# EAGLE design 1 (EAGLE 7.6.0)

## Sheet 1 of 2
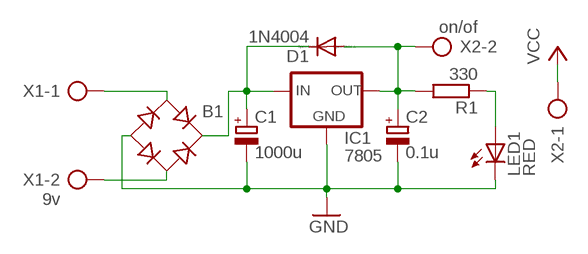
[diagram p0: schematic, sheet 1]

### Parts
B1  RB1A  [RB1A]
C1  1000u  CPOL-EUE3.5-8  [E3,5-8]
C2  0.1u  CPOL-EUE2-5  [E2-5]
D1  1N4004  [DO41-10]
IC1  7805  78XXS  [78XXS]
LED1  RED  LED5MM  [LED5MM]
R1  330  R-EU_0204/7  [0204/7]
X1  9v  AK500/2  [AK500/2]
X2  on/of  AK500/2  [AK500/2]

### Nets
GND: B1.- C1.- C2.- IC1.GND LED1.K(C) ; also sheet 2
N$1: B1.AC1 X1.1
N$2: B1.AC2 X1.2
N$3: B1.+ C1.+ D1.C IC1.IN
N$5: LED1.A R1.1
N$44: C2.+ D1.A IC1.OUT R1.2 X2.2
VCC: X2.1 ; also sheet 2

## Sheet 2 of 2
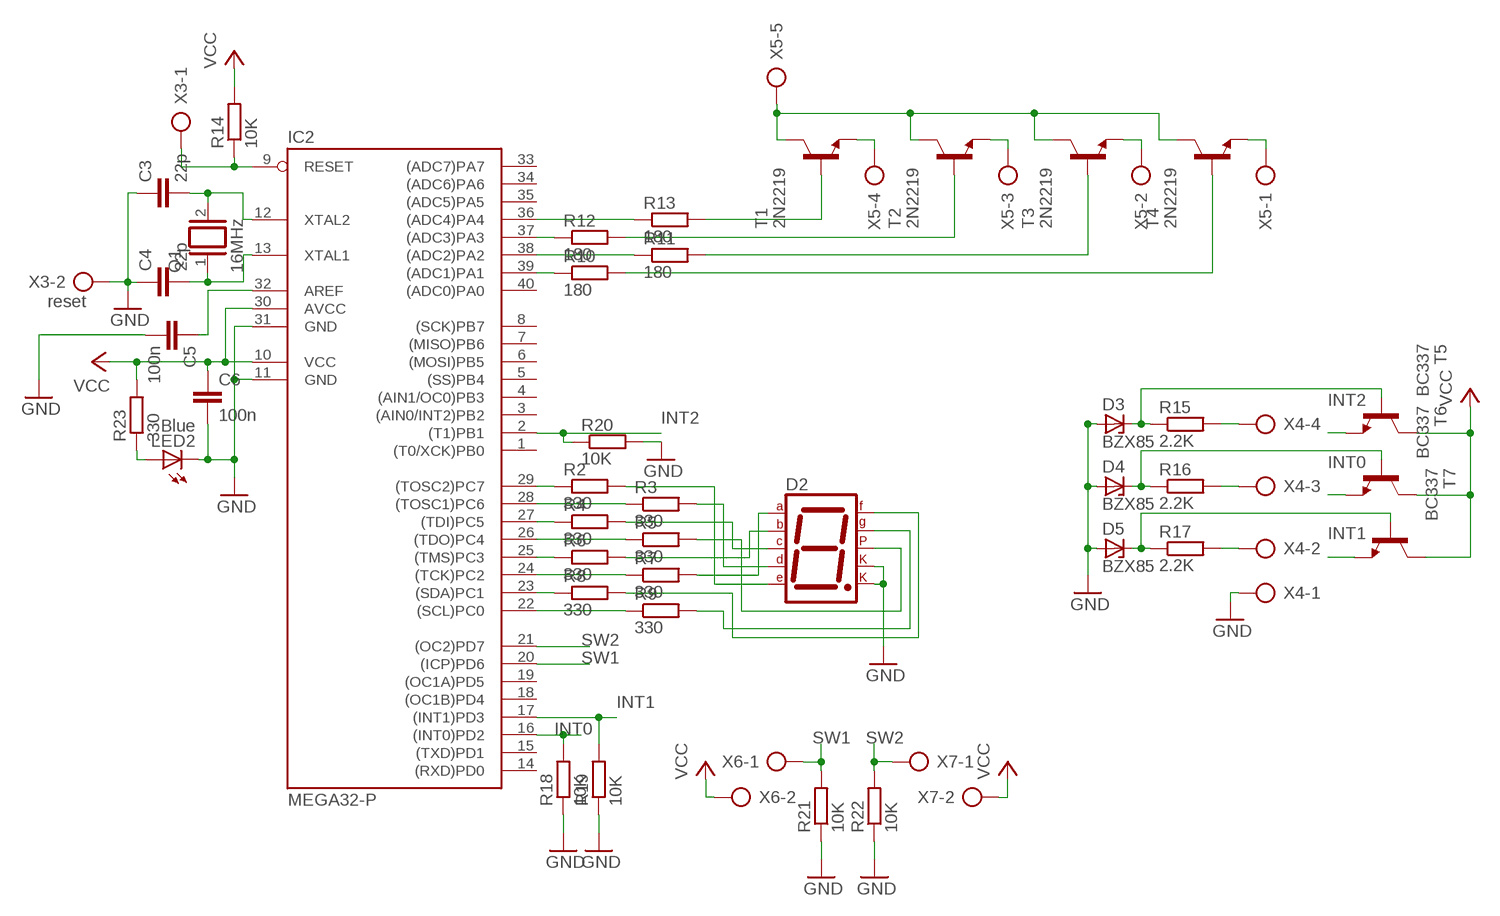
[diagram p1: schematic, sheet 2]

### Parts
C3  22p  C-EU025-024X044  [C025-024X044]
C4  22p  C-EU025-024X044  [C025-024X044]
C5  100n  C-EU025-024X044  [C025-024X044]
C6  100n  C-EU025-024X044  [C025-024X044]
D2  7SEG-CK  [7SEG-13]
D3  BZX85  [DO41Z10]
D4  BZX85  [DO41Z10]
D5  BZX85  [DO41Z10]
IC2  MEGA32-P  [DIL40]
LED2  Blue  LED5MM  [LED5MM]
Q1  16MHz  XTAL  [Q]
R2  330  R-EU_0204/7  [0204/7]
R3  330  R-EU_0204/7  [0204/7]
R4  330  R-EU_0204/7  [0204/7]
R5  330  R-EU_0204/7  [0204/7]
R6  330  R-EU_0204/7  [0204/7]
R7  330  R-EU_0204/7  [0204/7]
R8  330  R-EU_0204/7  [0204/7]
R9  330  R-EU_0204/7  [0204/7]
R10  180  R-EU_0204/7  [0204/7]
R11  180  R-EU_0204/7  [0204/7]
R12  180  R-EU_0204/7  [0204/7]
R13  180  R-EU_0204/7  [0204/7]
R14  10K  R-EU_0204/7  [0204/7]
R15  2.2K  R-EU_0207/10  [0207/10]
R16  2.2K  R-EU_0207/10  [0207/10]
R17  2.2K  R-EU_0207/10  [0207/10]
R18  10K  R-EU_0204/7  [0204/7]
R19  10K  R-EU_0204/7  [0204/7]
R20  10K  R-EU_0204/7  [0204/7]
R21  10K  R-EU_0204/7  [0204/7]
R22  10K  R-EU_0204/7  [0204/7]
R23  330  R-EU_0204/7  [0204/7]
T1  2N2219  [TO5]
T2  2N2219  [TO5]
T3  2N2219  [TO5]
T4  2N2219  [TO5]
T5  BC337  [TO92]
T6  BC337  [TO92]
T7  BC337  [TO92]
X3  reset  AK500/2  [AK500/2]
X4  AK500/4  [AK500/4]
X5  AK500/5  [AK500/5]
X6  AK500/2  [AK500/2]
X7  AK500/2  [AK500/2]

### Nets
GND: C3.1 C4.1 C5.2 C6.2 D2.3(CK1) D2.8(CK2) D3.A D4.A D5.A IC2.11(GND) IC2.31(GND) LED2.K(C) R18.1 R19.1 R20.2 R21.1 R22.1 X3.2 X4.1 ; also sheet 1
INT0: IC2.16((INT0)PD2) R18.2 T6.1(E)
INT1: IC2.17((INT1)PD3) R19.2 T7.1(E)
INT2: IC2.2((T1)PB1) R20.1 T5.1(E)
N$4: D2.1(E) R2.2
N$6: D2.2(D) R3.2
N$7: D2.4(C) R4.2
N$8: D2.5(DP) R5.2
N$9: D2.6(B) R6.2
N$10: D2.7(A) R7.2
N$11: D2.9(F) R8.2
N$12: D2.10(G) R9.2
N$13: IC2.29((TOSC2)PC7) R2.1
N$14: IC2.28((TOSC1)PC6) R3.1
N$15: IC2.27((TDI)PC5) R4.1
N$16: IC2.26((TDO)PC4) R5.1
N$17: IC2.25((TMS)PC3) R6.1
N$18: IC2.24((TCK)PC2) R7.1
N$19: IC2.23((SDA)PC1) R8.1
N$20: IC2.22((SCL)PC0) R9.1
N$21: IC2.39((ADC1)PA1) R10.1
N$22: IC2.38((ADC2)PA2) R11.1
N$23: IC2.37((ADC3)PA3) R12.1
N$24: IC2.36((ADC4)PA4) R13.1
N$25: LED2.A R23.1
N$26: C3.2 IC2.12(XTAL2) Q1.2
N$27: C4.2 IC2.13(XTAL1) Q1.1
N$28: IC2.9(RESET) R14.1 X3.1
N$29: D3.C R15.1 T5.2(B)
N$30: D4.C R16.1 T6.2(B)
N$31: D5.C R17.1 T7.2(B)
N$32: R15.2 X4.4
N$33: R16.2 X4.3
N$34: R17.2 X4.2
N$35: R12.2 T2.2(B)
N$36: R13.2 T1.2(B)
N$37: R11.2 T3.2(B)
N$38: R10.2 T4.2(B)
N$39: T1.3(C) T2.3(C) T3.3(C) T4.3(C) X5.5
N$40: T1.1(E) X5.4
N$41: T2.1(E) X5.3
N$42: T3.1(E) X5.2
N$43: T4.1(E) X5.1
N$45: C5.1 IC2.32(AREF)
SW1: IC2.20((ICP)PD6) R21.2 X6.1
SW2: IC2.21((OC2)PD7) R22.2 X7.1
VCC: C6.1 IC2.10(VCC) IC2.30(AVCC) R14.2 R23.2 T5.3(C) T6.3(C) T7.3(C) X6.2 X7.2 ; also sheet 1
Unconnected: IC2.1((T0/XCK)PB0) IC2.3((AIN0/INT2)PB2) IC2.4((AIN1/OC0)PB3) IC2.5((SS)PB4) IC2.6((MOSI)PB5) IC2.7((MISO)PB6) IC2.8((SCK)PB7) IC2.14((RXD)PD0) IC2.15((TXD)PD1) IC2.18((OC1B)PD4) IC2.19((OC1A)PD5) IC2.33((ADC7)PA7) IC2.34((ADC6)PA6) IC2.35((ADC5)PA5) IC2.40((ADC0)PA0)

## Library data of the parts
B1 = rectifier:RB1A: RECTIFIER 1 A
C1 C2 = rcl:CPOL-EU: POLARIZED CAPACITOR, European symbol
C3-C6 = rcl:C-EU: CAPACITOR, European symbol
D1 = diode:1N4004: DIODE general purpose rectifier, 1 A
D2 = special:7SEG-CK: 7-segment DISPLAY single cathode, 13 mm
D3-D5 = diode:BZX85: Z DIODE
IC1 = v-reg:78XXS: VOLTAGE REGULATOR
IC2 = atmel:MEGA32-P: MICROCONTROLLER 32 Kbytes FLASH 2 Kbytes SRAM 1 Kbytes EEPROM USART 8-channel 10 bit ADC Source: www.atmel.com .. doc2503.pdf; MPN: ATMEGA32-16PU; OC_FARNELL: 1661729; OC_NEWARK: 51P1794
LED1 LED2 = led:LED: LED OSRAM: - CHIPLED LG R971, LG N971, LY N971, LG Q971, LY Q971, LO R971, LY R971 LH N974, LH R974 LS Q976, LO Q976, LY Q976 LO Q996 - Hyper CHIPLED LW Q18S LB Q993, LB Q99A, LB R99A - SideLED LS A670, LO A670, LY A670, LG A670, LP A670 LB A673, LV A673, LT A673, LW A673 LH A674 LY A675 LS A676, LA A676, LO A676, LY A676, LW A676 LS A679, LY A679, LG A679 - Hyper Micro SIDELED® LS Y876, LA Y876, LO Y876, LY Y876 LT Y87S - SmartLED LW L88C, LW L88S LB L89C, LB L89S, LG L890 LS L89K, LO L89K, LY L89K LS L896, LA L896, LO L896, LY L896 - TOPLED LS T670, LO T670, LY T670, LG T670, LP T670 LSG T670, LSP T670, LSY T670, LOP T670, LYG T670 LG T671, LOG T671, LSG T671 LB T673, LV T673, LT T673, LW T673 LH T674 LS T676, LA T676, LO T676, LY T676, LB T676, LH T676, LSB T676, LW T676 LB T67C, LV T67C, LT T67C, LS T67K, LO T67K, LY T67K, LW E67C LS E67B, LA E67B, LO E67B, LY E67B, LB E67C, LV E67C, LT E67C LW T67C LS T679, LY T679, LG T679 LS T770, LO T770, LY T770, LG T770, LP T770 LB T773, LV T773, LT T773, LW T773 LH T774 LS E675, LA E675, LY E675, LS T675 LS T776, LA T776, LO T776, LY T776, LB T776 LHGB T686 LT T68C, LB T68C - Hyper Mini TOPLED® LB M676 - Mini TOPLED Santana® LG M470 LS M47K, LO M47K, LY M47K Source: http://www.osram.convergy.de LUXEON: - LUMILED® LXK2-PW12-R00, LXK2-PW12-S00, LXK2-PW14-U00, LXK2-PW14-V00 LXK2-PM12-R00, LXK2-PM12-S00, LXK2-PM14-U00 LXK2-PE12-Q00, LXK2-PE12-R00, LXK2-PE12-S00, LXK2-PE14-T00, LXK2-PE14-U00 LXK2-PB12-K00, LXK2-PB12-L00, LXK2-PB12-M00, LXK2-PB14-N00, LXK2-PB14-P00, LXK2-PB14-Q00 LXK2-PR12-L00, LXK2-PR12-M00, LXK2-PR14-Q00, LXK2-PR14-R00 LXK2-PD12-Q00, LXK2-PD12-R00, LXK2-PD12-S00 LXK2-PH12-R00, LXK2-PH12-S00 LXK2-PL12-P00, LXK2-PL12-Q00, LXK2-PL12-R00 Source: www.luxeon.com KINGBRIGHT: KA-3528ASYC Source: www.kingbright.com
Q1 = special:XTAL: CRYSTAL
R1-R23 = rcl:R-EU_: RESISTOR, European symbol
T1-T4 = transistor:2N2219: NPN TRANSISTOR
T5-T7 = transistor:BC337: NPN TRANSISTOR
X1-X3 X6 X7 = con-ptr500:AK500/2: CONNECTOR; OC_FARNELL: unknown; OC_NEWARK: unknown
X4 = con-ptr500:AK500/4: CONNECTOR; OC_FARNELL: unknown; OC_NEWARK: unknown
X5 = con-ptr500:AK500/5: CONNECTOR; OC_FARNELL: unknown; OC_NEWARK: unknown

## Board
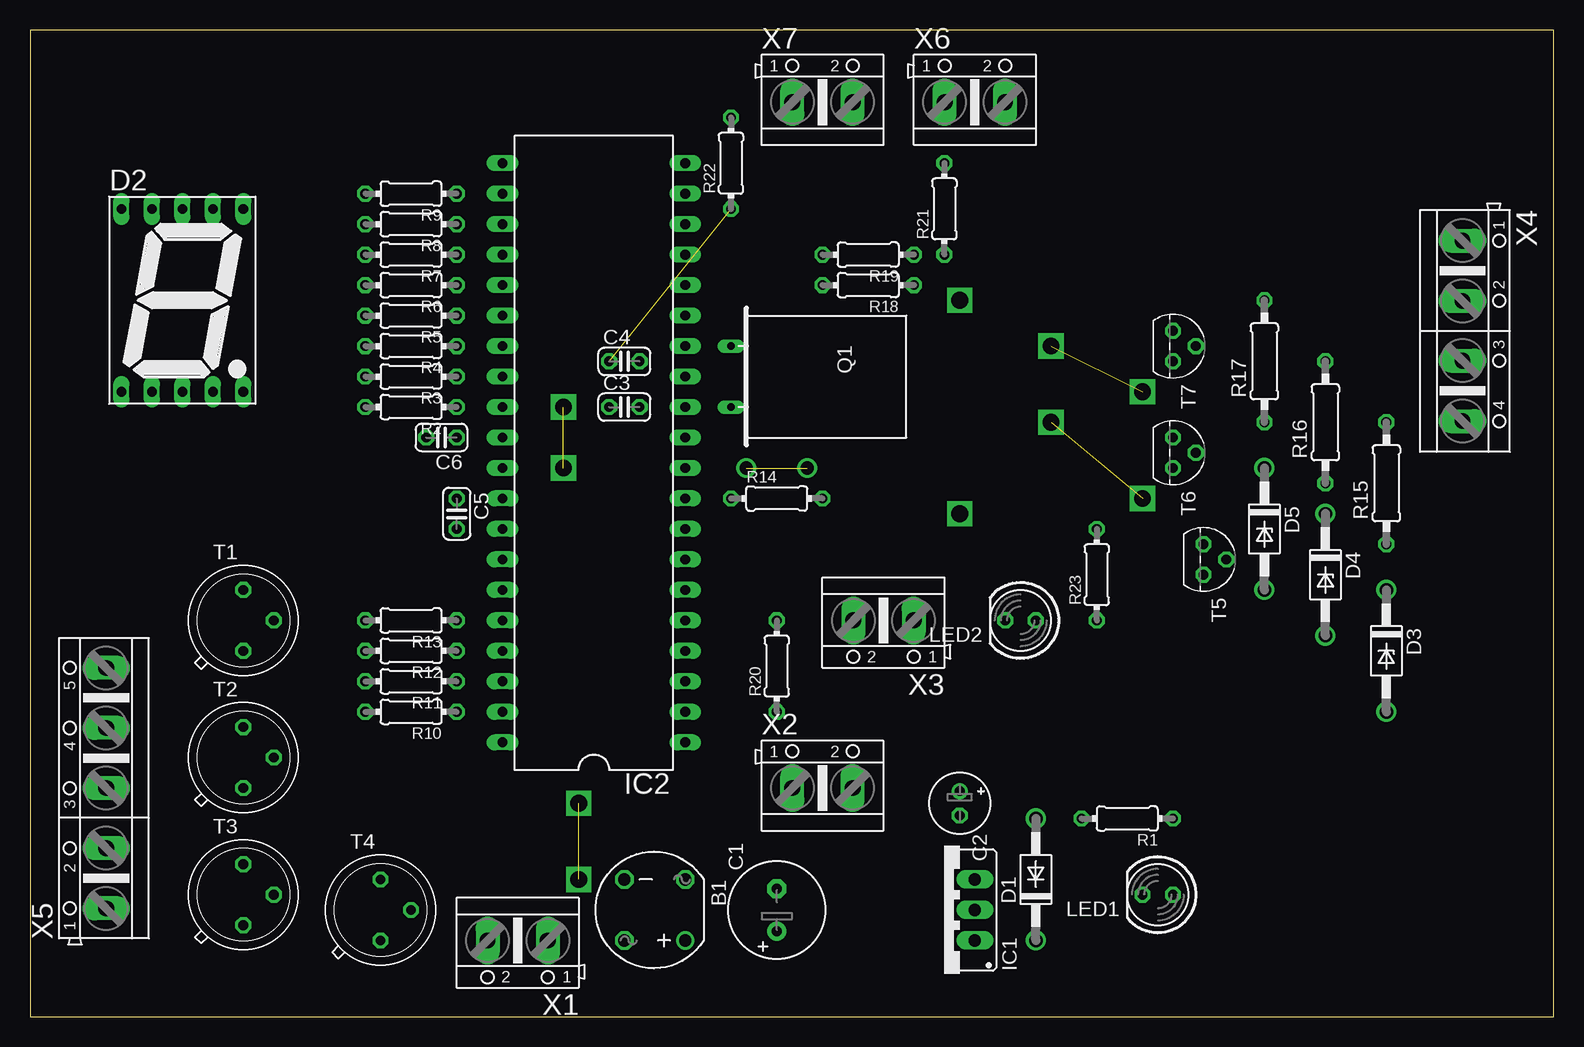
[diagram p2: board, top side]
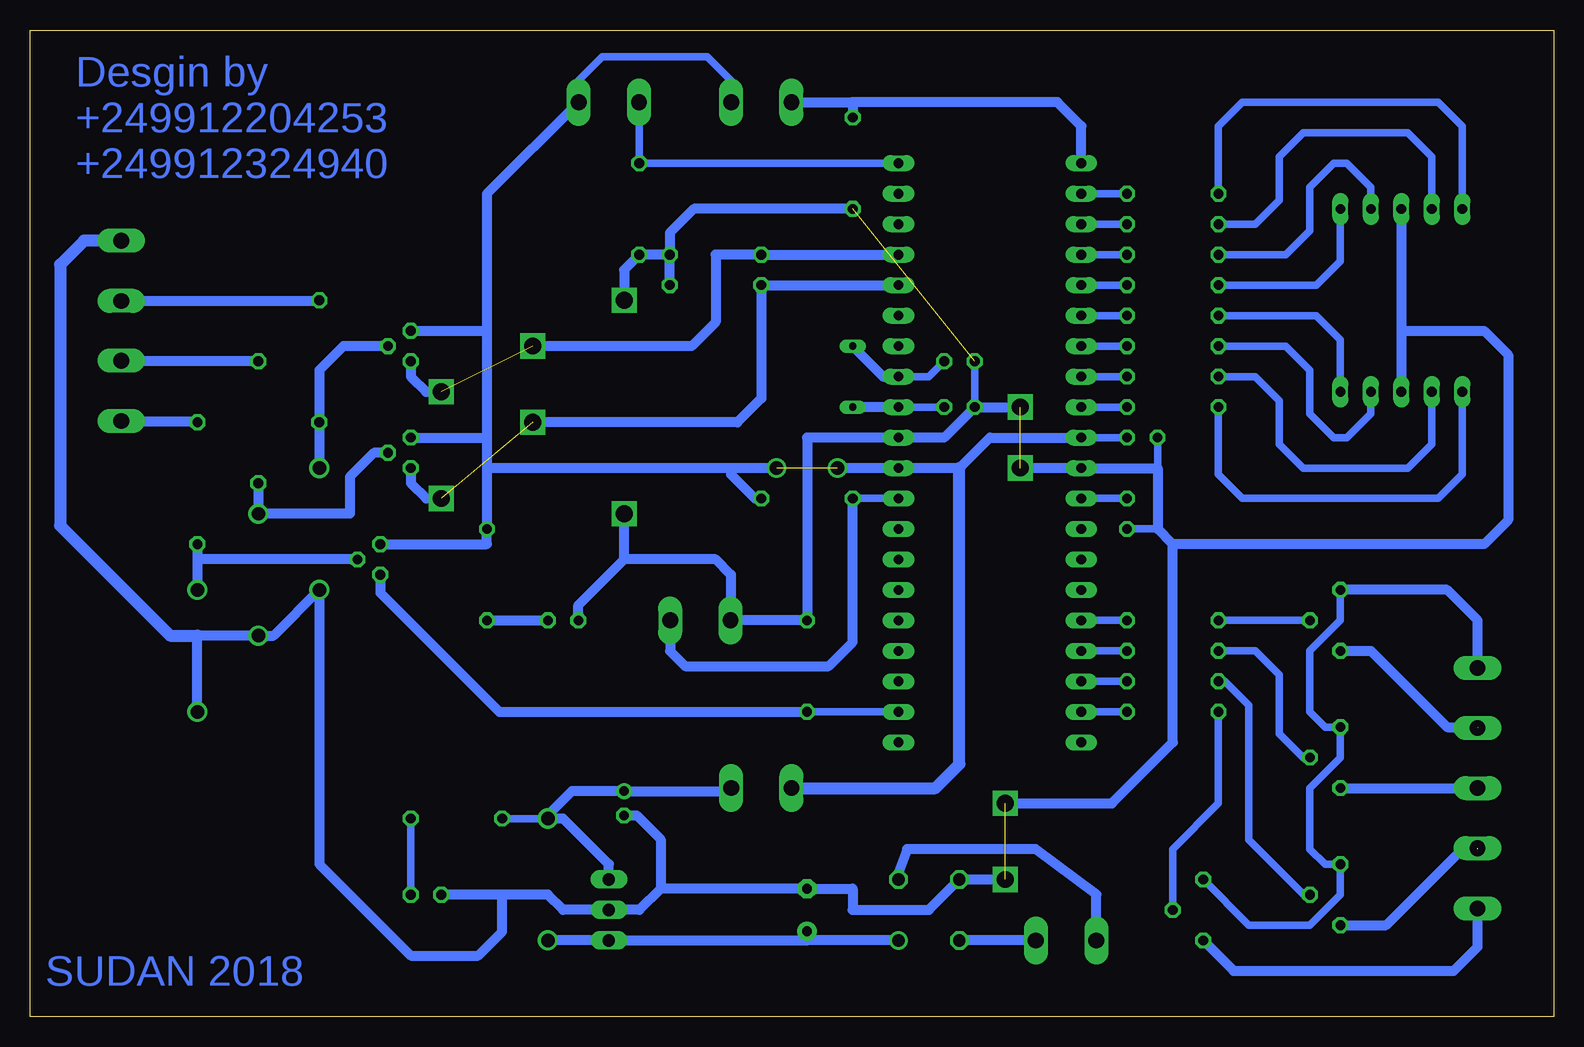
[diagram p3: board, bottom side, seen from below]

Size 126.98 x 82.22 mm. Coordinates in mm from the lower left corner, seen from the top.
Outline: 0,0 126.98,0 126.98,82.22 0,82.22 0,0
Copper layers (1*16): Top 0.035mm / dielectric 1.5mm / Bottom 0.035mm
Design rules "default": minimum track width 10mil, minimum drill 24mil, track to track 8mil, track to pad 8mil, pad to pad 8mil, via to via 8mil, smd to smd 8mil, copper to edge 40mil, drill to drill 8mil, minimum pad ring 10mil, minimum via ring 8mil, stop-mask expansion 4mil, vias tented up to drill 0mil, thermal gap 10mil

### Footprints (pad centres in the part's own frame; a part is rotated, then mirrored left to right if it is on the bottom)
RB1A = drill 1.016: + -2.54,2.54 | drill 1.016 octagon: - 2.54,-2.54; AC1 2.54,2.54; AC2 -2.54,-2.54
E3,5-8 = drill 0.813 pad 1.6: + -1.778,0 | drill 0.813 pad 1.6 octagon: - 1.778,0
E2-5 = drill 0.813 pad 1.27: + -1.016,0 | drill 0.813 pad 1.27 octagon: - 1.016,0
C025-024X044 = drill 0.813 octagon: 1 -1.27,0; 2 1.27,0
DO41-10 = drill 1.118: A 5.08,0; C -5.08,0
7SEG-13 = drill 0.813 long: 1 -5.08,-7.62; 2 -2.54,-7.62; 3 0,-7.62; 4 2.54,-7.62; 5 5.08,-7.62; 6 5.08,7.62; 7 2.54,7.62; 8 0,7.62; 9 -2.54,7.62; 10 -5.08,7.62
DO41Z10 = drill 1.118: A 5.08,0; C -5.08,0
78XXS = drill 1.016 long: GND 0,-2.54; IN -2.54,-2.54; OUT 2.54,-2.54
DIL40 = drill 0.813 long: 1 -24.13,-7.62; 2 -21.59,-7.62; 3 -19.05,-7.62; 4 -16.51,-7.62; 5 -13.97,-7.62; 6 -11.43,-7.62; 7 -8.89,-7.62; 8 -6.35,-7.62; 9 -3.81,-7.62; 10 -1.27,-7.62; 11 1.27,-7.62; 12 3.81,-7.62; 13 6.35,-7.62; 14 8.89,-7.62; 15 11.43,-7.62; 16 13.97,-7.62; 17 16.51,-7.62; 18 19.05,-7.62; 19 21.59,-7.62; 20 24.13,-7.62; 21 24.13,7.62; 22 21.59,7.62; 23 19.05,7.62; 24 16.51,7.62; 25 13.97,7.62; 26 11.43,7.62; 27 8.89,7.62; 28 6.35,7.62; 29 3.81,7.62; 30 1.27,7.62; 31 -1.27,7.62; 32 -3.81,7.62; 33 -6.35,7.62; 34 -8.89,7.62; 35 -11.43,7.62; 36 -13.97,7.62; 37 -16.51,7.62; 38 -19.05,7.62; 39 -21.59,7.62; 40 -24.13,7.62
LED5MM = drill 0.813 octagon: A -1.27,0; K 1.27,0
Q = drill 0.61 long: 1 -2.54,-7.62; 2 2.54,-7.62
0204/7 = drill 0.813 octagon: 1 -3.81,0; 2 3.81,0
0207/10 = drill 0.813 octagon: 1 -5.08,0; 2 5.08,0
TO5 = drill 0.813 octagon: 1 0,-2.54; 2 2.54,0; 3 0,2.54
TO92 = drill 0.813 octagon: 1 1.27,0; 2 0,1.905; 3 -1.27,0
AK500/2 = drill 1.321 long: 1 -2.515,0; 2 2.515,0
AK500/4 = drill 1.321 long: 1 -7.518,0; 2 -2.489,0; 3 2.489,0; 4 7.518,0
AK500/5 = drill 1.321 long: 1 -10.033,0; 2 -5.004,0; 3 0,0; 4 5.004,0; 5 10.008,0

### Placement (x,y rotation side)
B1  52.07,8.89 180 top
C1  62.23,8.89 90 top
C2  77.47,17.78 270 top
C3  49.53,50.8 0 top
C4  49.53,54.61 0 top
C5  35.56,41.91 270 top
C6  34.29,48.26 180 top
D1  83.82,11.43 90 top
D2  12.7,59.69 0 top
D3  113.03,30.48 270 top
D4  107.95,36.83 270 top
D5  102.87,40.64 270 top
IC1  76.2,8.89 90 top
IC2  46.99,46.99 90 top
LED1  93.98,10.16 180 top
LED2  82.55,33.02 180 top
Q1  66.04,53.34 270 top
R1  91.44,16.51 180 top
R2  31.75,50.8 180 top
R3  31.75,53.34 180 top
R4  31.75,55.88 180 top
R5  31.75,58.42 180 top
R6  31.75,60.96 180 top
R7  31.75,63.5 180 top
R8  31.75,66.04 180 top
R9  31.75,68.58 180 top
R10  31.75,25.4 180 top
R11  31.75,27.94 180 top
R12  31.75,30.48 180 top
R13  31.75,33.02 180 top
R14  62.23,43.18 0 top
R15  113.03,44.45 90 top
R16  107.95,49.53 90 top
R17  102.87,54.61 90 top
R18  69.85,60.96 180 top
R19  69.85,63.5 180 top
R20  62.23,29.21 90 top
R21  76.2,67.31 90 top
R22  58.42,71.12 90 top
R23  88.9,36.83 90 top
T1  17.78,33.02 0 top
T2  17.78,21.59 0 top
T3  17.78,10.16 0 top
T4  29.21,8.89 0 top
T5  97.79,38.1 270 top
T6  95.25,46.99 270 top
T7  95.25,55.88 270 top
X1  40.64,6.35 180 top
X2  66.04,19.05 0 top
X3  71.12,33.02 180 top
X4  119.38,57.15 270 top
X5  6.35,19.05 90 top
X6  78.74,76.2 0 top
X7  66.04,76.2 0 top

### Tracks (layer width: path | path; a pad name or v marks a point on that pad's centre or on a via)
GND  (via drill 1.4)  (3 unrouted)
  Bottom 0.61: C4.1 C3.1 | C6.2 33.02,45.72 | C5.2 33.02,40.64
  Bottom 0.813: D3.A 113.03,31.75 D4.A 106.68,31.75 D5.A 102.87,12.7 95.25,5.08 89.63,5.08 87.63,7.08 87.63,10.16 | 74.42,10.67 C1.- 58.42,10.67 58.42,8.89 52.07,8.89 B1.- 45.72,11.43 | 74.42,10.67 76.2,8.89 IC1.GND 82.55,8.89 83.82,10.16 87.63,10.16 | C2.- 76.42,16.76 74.42,14.76 74.42,10.67 | v44.45,45.72 IC2.31 33.02,45.72 33.02,40.64 31.75,39.37 | 87.63,10.16 LED1.K | 68.58,33.02 X3.2 68.58,33.05 | LED2.K 81.28,34.29 77.47,38.1 | 68.58,33.05 68.58,36.83 69.85,38.1 77.47,38.1 | D2.8 12.7,57.15 | 12.7,57.15 D2.3 | 12.7,57.15 5.81,57.15 3.81,55.15 3.81,41.37 5.81,39.37 31.75,39.37 | R18.1 R19.1 | R22.1 71.66,67.31 73.66,65.31 R19.1 | R19.1 R21.1 77.47,62.23 v77.47,59.69 | 68.58,33.02 R20.2 62.23,48.26 IC2.11 50.8,48.26 C3.1 44.45,50.8 | 68.58,33.02 68.58,33.05 | 77.47,38.1 v77.47,41.91 | 45.72,17.78 36.83,17.78 31.75,22.86 31.75,39.37
  Bottom 1.016: X4.1 122.46,64.67 124.46,62.67 124.46,40.91 115.3,31.75 113.03,31.75
INT0  (via drill 1.4)  (1 unrouted)
  Bottom 0.813: IC2.16 R18.2 66.04,51.53 68.04,49.53 v85.09,49.53 | T6.1 95.25,44.45 93.98,43.18 v92.71,43.18
INT1  (via drill 1.4)  (1 unrouted)
  Bottom 0.813: IC2.17 R19.2 69.85,63.5 69.85,57.88 71.85,55.88 v85.09,55.88 | T7.1 95.25,53.34 93.98,52.07 v92.71,52.07
INT2
  Bottom 0.61: IC2.2 R20.1
  Bottom 0.813: T5.1 97.79,35.32 87.87,25.4 R20.1
N$1
  Bottom 0.813: X1.1 B1.AC1
N$2
  Bottom 0.813: X1.2 38.12,10.19 43.18,13.97 53.88,13.97 54.61,11.97 B1.AC2
N$3
  Bottom 0.813: B1.+ 62.23,6.35 | C1.+ 62.23,6.35 | 62.23,6.35 IC1.IN D1.C
N$4
  Bottom 0.61: R2.2 27.94,45.18 25.94,43.18 9.62,43.18 7.62,45.18 D2.1
N$5
  Bottom 0.61: LED1.A R1.1
N$6
  Bottom 0.61: R3.2 24.86,53.34 22.86,51.34 22.86,47.72 20.86,45.72 12.16,45.72 10.16,47.72 D2.2
N$7
  Bottom 0.61: R4.2 22.32,55.88 20.32,53.88 20.32,50.26 18.32,48.26 17.24,48.26 15.24,50.26 D2.4
N$8
  Bottom 0.61: R5.2 19.78,58.42 17.78,56.42 D2.5
N$9
  Bottom 0.61: R6.2 19.78,60.96 17.78,62.96 D2.6
N$10
  Bottom 0.61: R7.2 22.32,63.5 20.32,65.5 20.32,69.12 18.32,71.12 17.24,71.12 15.24,69.12 D2.7
N$11
  Bottom 0.61: R8.2 24.86,66.04 22.86,68.04 22.86,71.66 20.86,73.66 12.16,73.66 10.16,71.66 D2.9
N$12
  Bottom 0.61: R9.2 27.94,74.2 25.94,76.2 9.62,76.2 7.62,74.2 D2.10
N$13
  Bottom 0.61: IC2.29 R2.1
N$14
  Bottom 0.61: IC2.28 R3.1
N$15
  Bottom 0.61: IC2.27 R4.1
N$16
  Bottom 0.61: IC2.26 R5.1
N$17
  Bottom 0.61: IC2.25 R6.1
N$18
  Bottom 0.61: IC2.24 R7.1
N$19
  Bottom 0.61: IC2.23 R8.1
N$20
  Bottom 0.61: IC2.22 R9.1
N$21
  Bottom 0.61: R10.1 IC2.39
N$22
  Bottom 0.61: R11.1 IC2.38
N$23
  Bottom 0.61: R12.1 IC2.37
N$24
  Bottom 0.61: IC2.36 R13.1
N$25
  Bottom 0.813: R23.1 LED2.A
N$26
  Bottom 0.61: C3.2 IC2.12
  Bottom 0.813: IC2.12 Q1.2
N$27
  Bottom 0.61: C4.2 52.07,53.34 IC2.13
  Bottom 0.813: Q1.1 55.88,53.34 IC2.13
N$28
  Bottom 0.61: IC2.9 R14.1
  Bottom 0.813: X3.1 73.64,30.45 72.39,29.21 60.42,29.21 58.42,31.21 R14.1
N$29
  Bottom 0.813: R15.1 113.03,38.1 | 113.03,38.1 D3.C | T5.2 113.03,38.1
N$30
  Bottom 0.813: R16.1 D4.C 100.33,41.91 100.33,44.99 98.33,46.99 T6.2
N$31
  Bottom 0.813: D5.C 102.87,48.26 R17.1 102.87,53.88 100.87,55.88 T7.2
N$32
  Bottom 0.813: X4.4 113.13,49.63 R15.2
N$33
  Bottom 0.813: X4.3 108,54.66 R16.2
N$34
  Bottom 0.813: X4.2 102.92,59.64 R17.2
N$35
  Bottom 0.61: R12.2 24.86,30.48 22.86,28.48 22.86,23.59 20.86,21.59 T2.2
N$36
  Bottom 0.61: R13.2 T1.2
N$37
  Bottom 0.61: R11.2 27.4,27.94 25.4,25.94 25.4,14.74 20.82,10.16 T3.2
N$38
  Bottom 0.61: T4.2 31.75,13.97 27.94,17.78 R10.2
N$39
  Bottom 0.61: T1.3 17.78,33.02 20.32,30.48 20.32,25.4 19.05,24.13 T2.3 17.78,21.59 20.32,19.05 20.32,13.97 19.05,12.7 T3.3 17.78,10.16 20.32,7.62 25.4,7.62 T4.3
  Bottom 0.813: X5.5 6.35,33.02 8.89,35.56 T1.3
N$40  (1 unrouted)
  Bottom 0.813: T1.1 15.24,30.48 8.89,24.13 6.35,24.13
N$41
  Bottom 0.813: T2.1 X5.3
N$42  (1 unrouted)
  Bottom 0.813: T3.1 13.97,7.62 7.62,13.97 6.35,13.97
N$43
  Bottom 0.813: T4.1 26.67,3.81 8.35,3.81 6.35,5.81 X5.1
N$44
  Bottom 0.61: R1.2 D1.A
  Bottom 0.813: IC1.OUT 78.74,12.7 82.55,16.51 D1.A 83.82,16.8 81.82,18.8 C2.+ 68.56,18.8 X2.2
N$45
  Bottom 0.61: IC2.32 C5.1
N$47  (via drill 1.1)
  other vias: 64.77,45.72
N$49  (via drill 1.4)
  other vias: 44.45,50.8
N$50  (via drill 1.4)
  other vias: 45.72,17.78
N$51  (via drill 1.4)
  other vias: 45.72,11.43
SW1
  Bottom 0.61: IC2.20 R21.2 76.2,76.17 X6.1
SW2
  Bottom 0.813: X7.1 58.42,76.2 | 58.42,76.2 R22.2 | IC2.21 39.37,74.2 41.37,76.2 58.42,76.2
VCC  (via drill 1.1)  (1 unrouted)
  Bottom 0.61: X7.2 68.56,78.01 70.56,80.01 79.28,80.01 81.28,78.01 81.28,76.22 X6.2 | IC2.30 C6.1 | 68.58,45.18 68.58,45.72
  Bottom 0.813: IC2.30 46.99,48.26 49.53,45.72 IC2.10 v59.69,45.72 | T6.3 88.9,48.26 | 88.9,48.26 88.9,45.72 | 88.9,45.72 R23.2 88.9,39.37 T5.3 | T7.3 88.9,57.15 | 88.9,57.15 88.9,48.26 | X6.2 88.9,68.56 88.9,57.15 | 64.77,45.72 68.58,45.72 88.9,45.72 | R14.2 66.58,43.18 68.58,45.18
  Bottom 1.016: X2.1 51.53,19.05 49.53,21.05 49.53,45.72

### Text on the board
Bottom: Desgin by | +249912204253 | +249912324940 | SUDAN 2018